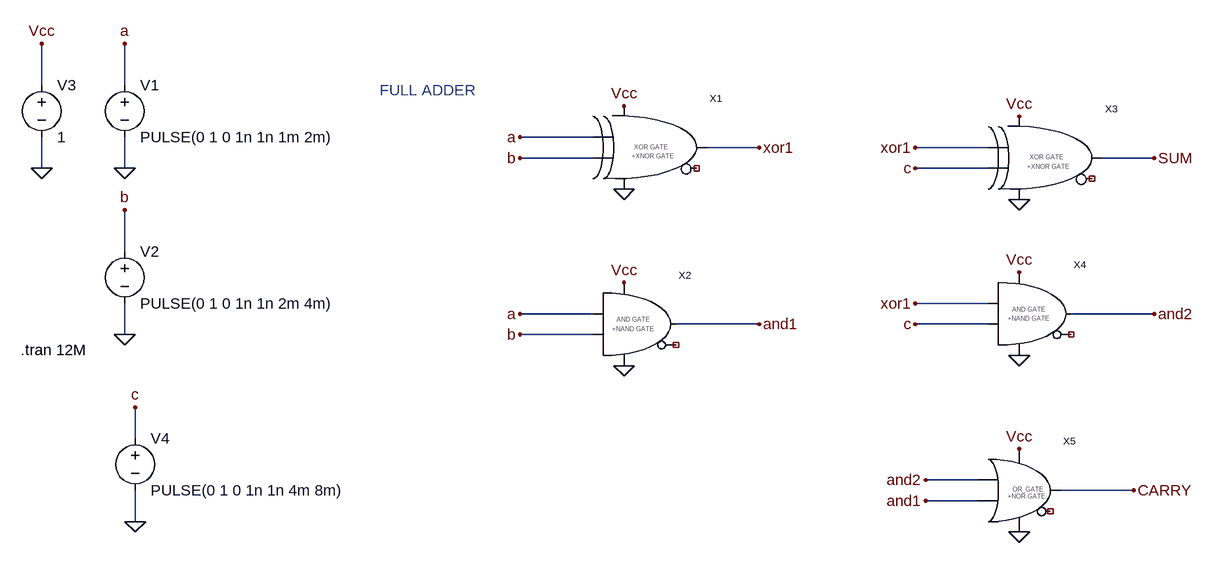
[diagram p0: schematic Draft68.asc]
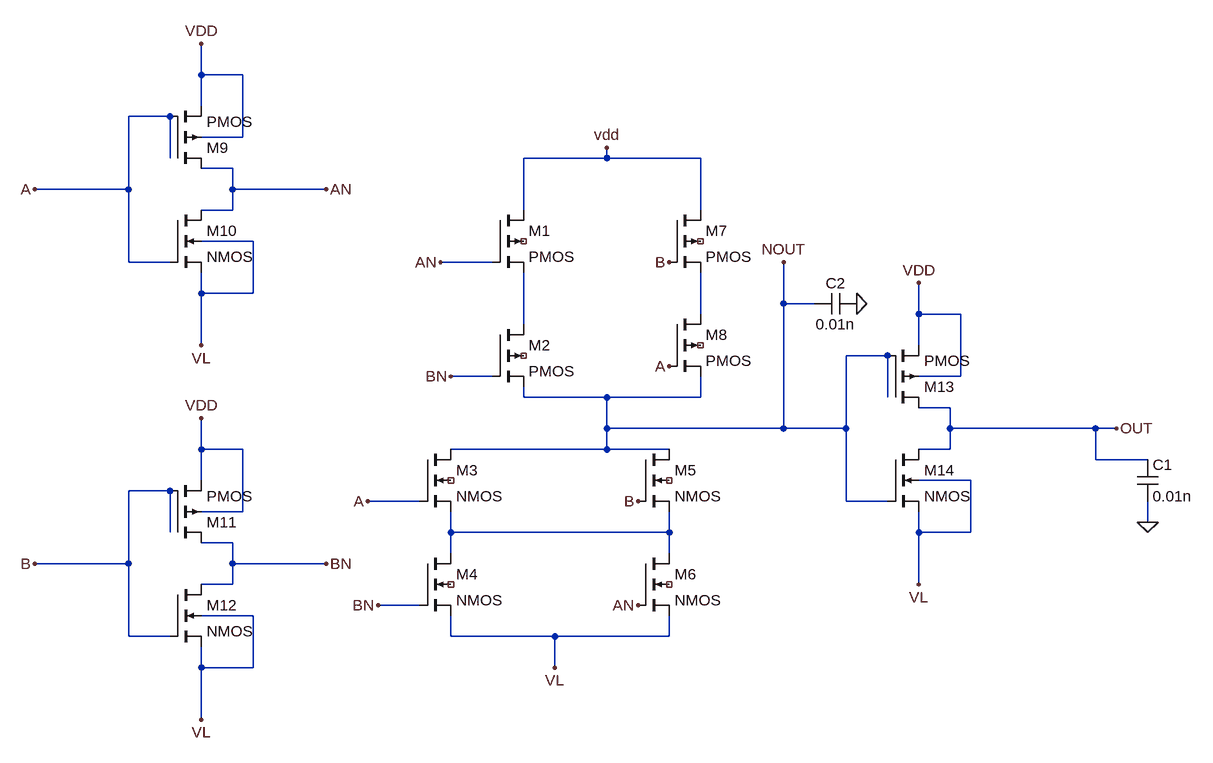
[diagram p1: sub-circuit xor_gate.asc]
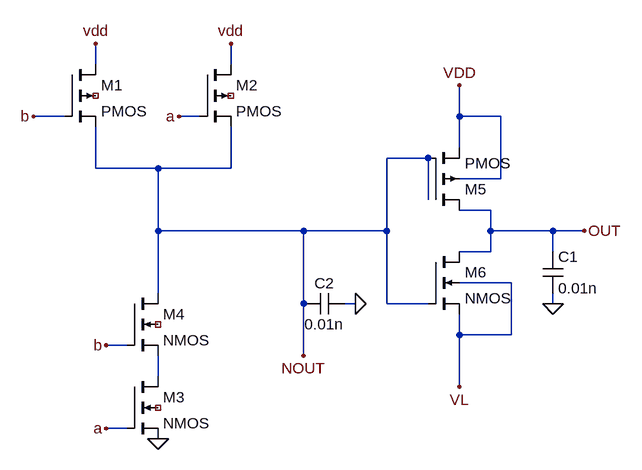
[diagram p2: sub-circuit and_gate1.asc]
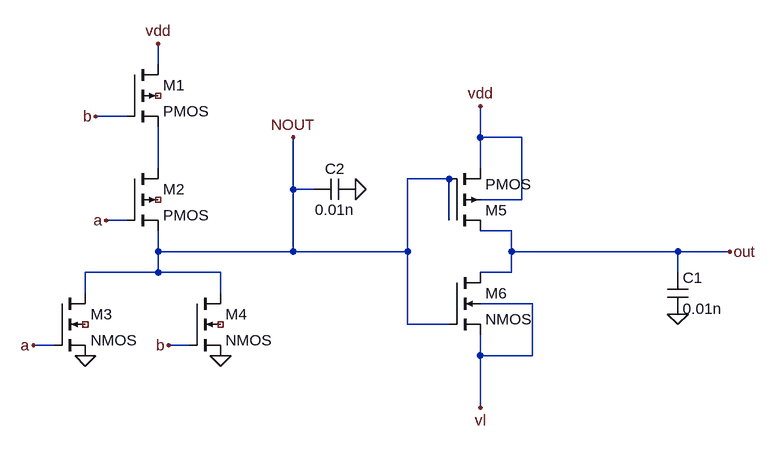
[diagram p3: sub-circuit or_gate1.asc]
Draft68.asc, the LTspice schematic file:
Version 4
SHEET 1 1216 680
WIRE -592 -144 -592 -208
WIRE -464 -144 -464 -208
WIRE 256 -64 144 -64
WIRE 512 -48 432 -48
WIRE 864 -48 752 -48
WIRE 256 -32 144 -32
WIRE 1120 -32 1040 -32
WIRE -592 -16 -592 -64
WIRE -464 -16 -464 -64
WIRE 864 -16 752 -16
WIRE -464 112 -464 48
WIRE 864 192 752 192
WIRE 256 208 144 208
WIRE 1120 208 992 208
WIRE 512 224 384 224
WIRE 864 224 752 224
WIRE -464 240 -464 192
WIRE 256 240 144 240
WIRE -448 400 -448 352
WIRE 848 464 768 464
WIRE 1088 480 976 480
WIRE 848 496 768 496
WIRE -448 528 -448 480
FLAG -592 -208 Vcc
FLAG -464 240 0
FLAG -464 -16 0
FLAG -592 -16 0
FLAG -464 -208 a
FLAG -464 48 b
FLAG 144 -64 a
FLAG 144 -32 b
FLAG 144 208 a
FLAG 144 240 b
FLAG 304 -112 Vcc
FLAG 304 160 Vcc
FLAG 304 16 0
FLAG 304 288 0
FLAG 512 224 and1
FLAG 512 -48 xor1
FLAG 752 -48 xor1
FLAG 752 -16 c
FLAG 912 -96 Vcc
FLAG 912 32 0
FLAG 1120 -32 SUM
FLAG 752 192 xor1
FLAG 752 224 c
FLAG 912 144 Vcc
FLAG 912 272 0
FLAG 1120 208 and2
FLAG -448 528 0
FLAG -448 352 c
FLAG 768 496 and1
FLAG 768 464 and2
FLAG 1088 480 CARRY
FLAG 912 416 Vcc
FLAG 912 544 0
SYMBOL XOR_GATE 256 -32 R0
SYMATTR InstName X1
SYMBOL AND_GATE1 208 240 R0
SYMATTR InstName X2
SYMBOL voltage -464 -160 R0
WINDOW 123 0 0 Left 0
WINDOW 39 0 0 Left 0
SYMATTR InstName V1
SYMATTR Value PULSE(0 1 0 1n 1n 1m 2m)
SYMBOL voltage -464 96 R0
WINDOW 123 0 0 Left 0
WINDOW 39 0 0 Left 0
SYMATTR InstName V2
SYMATTR Value PULSE(0 1 0 1n 1n 2m 4m)
SYMBOL voltage -592 -160 R0
WINDOW 123 0 0 Left 0
WINDOW 39 0 0 Left 0
SYMATTR InstName V3
SYMATTR Value 1
SYMBOL XOR_GATE 864 -16 R0
SYMATTR InstName X3
SYMBOL AND_GATE1 816 224 R0
SYMATTR InstName X4
SYMBOL or_gate1 816 512 R0
SYMATTR InstName X5
SYMBOL voltage -448 384 R0
WINDOW 123 0 0 Left 0
WINDOW 39 0 0 Left 0
SYMATTR InstName V4
SYMATTR Value PULSE(0 1 0 1n 1n 4m 8m)
TEXT -624 264 Left 2 !.tran 12M
TEXT -72 -136 Left 2 ;FULL ADDER

xor_gate.asc, the sub-circuit schematic file:
Version 4
SHEET 1 1020 680
WIRE -512 -432 -512 -480
WIRE -448 -432 -512 -432
WIRE -512 -384 -512 -432
WIRE -560 -368 -624 -368
WIRE -448 -336 -448 -432
WIRE -448 -336 -512 -336
WIRE -560 -304 -560 -368
WIRE 112 -304 112 -320
WIRE 112 -304 -16 -304
WIRE 256 -304 112 -304
WIRE -464 -288 -512 -288
WIRE -624 -256 -624 -368
WIRE -624 -256 -768 -256
WIRE -464 -256 -464 -288
WIRE -320 -256 -464 -256
WIRE -464 -224 -464 -256
WIRE -464 -224 -512 -224
WIRE -16 -224 -16 -304
WIRE 256 -224 256 -304
WIRE -432 -176 -512 -176
WIRE -624 -144 -624 -256
WIRE -560 -144 -624 -144
WIRE -64 -144 -144 -144
WIRE -512 -96 -512 -128
WIRE -432 -96 -432 -176
WIRE -432 -96 -512 -96
WIRE 384 -80 384 -144
WIRE 432 -80 384 -80
WIRE 256 -64 256 -128
WIRE 592 -64 592 -112
WIRE 656 -64 592 -64
WIRE -16 -48 -16 -128
WIRE -512 -16 -512 -96
WIRE 592 -16 592 -64
WIRE 544 0 480 0
WIRE -64 32 -128 32
WIRE 656 32 656 -64
WIRE 656 32 592 32
WIRE -16 64 -16 48
WIRE 112 64 -16 64
WIRE 256 64 256 32
WIRE 256 64 112 64
WIRE 544 64 544 0
WIRE 640 80 592 80
WIRE 112 112 112 64
WIRE 384 112 384 -80
WIRE 384 112 112 112
WIRE 480 112 480 0
WIRE 480 112 384 112
WIRE 640 112 640 80
WIRE 864 112 640 112
WIRE 896 112 864 112
WIRE -512 144 -512 96
WIRE -448 144 -512 144
WIRE 112 144 112 112
WIRE 112 144 -128 144
WIRE 208 144 112 144
WIRE 640 144 640 112
WIRE 640 144 592 144
WIRE 864 160 864 112
WIRE 944 160 864 160
WIRE -512 192 -512 144
WIRE 672 192 592 192
WIRE -560 208 -624 208
WIRE -176 224 -256 224
WIRE 480 224 480 112
WIRE 544 224 480 224
WIRE -448 240 -448 144
WIRE -448 240 -512 240
WIRE 944 256 944 224
WIRE -560 272 -560 208
WIRE -128 272 -128 240
WIRE 208 272 208 240
WIRE 208 272 -128 272
WIRE 592 272 592 240
WIRE 672 272 672 192
WIRE 672 272 592 272
WIRE -464 288 -512 288
WIRE -128 304 -128 272
WIRE 208 304 208 272
WIRE -624 320 -624 208
WIRE -624 320 -768 320
WIRE -464 320 -464 288
WIRE -320 320 -464 320
WIRE -464 352 -464 320
WIRE -464 352 -512 352
WIRE 592 352 592 272
WIRE -176 384 -240 384
WIRE -432 400 -512 400
WIRE -624 432 -624 320
WIRE -560 432 -624 432
WIRE -128 432 -128 400
WIRE 32 432 -128 432
WIRE 208 432 208 400
WIRE 208 432 32 432
WIRE -512 480 -512 448
WIRE -432 480 -432 400
WIRE -432 480 -512 480
WIRE 32 480 32 432
WIRE -512 560 -512 480
FLAG -144 -144 AN
FLAG 160 224 B
FLAG -256 224 A
FLAG -128 32 BN
FLAG 112 -320 vdd
FLAG 208 -144 B
FLAG 208 16 A
FLAG -240 384 BN
FLAG 896 112 OUT
FLAG 160 384 AN
FLAG 944 256 0
FLAG -320 -256 AN
FLAG -512 -16 VL
FLAG -512 -480 VDD
FLAG -768 -256 A
FLAG -320 320 BN
FLAG -512 560 VL
FLAG -512 96 VDD
FLAG -768 320 B
FLAG 32 480 VL
FLAG 592 352 VL
FLAG 592 -112 VDD
FLAG 384 -144 NOUT
FLAG 496 -80 0
SYMBOL pmos4 -64 -224 R0
SYMATTR InstName M1
SYMBOL pmos4 -64 -48 R0
SYMATTR InstName M2
SYMBOL nmos4 -176 144 R0
SYMATTR InstName M3
SYMBOL nmos4 -176 304 R0
SYMATTR InstName M4
SYMBOL nmos4 160 144 R0
SYMATTR InstName M5
SYMBOL nmos4 160 304 R0
SYMATTR InstName M6
SYMBOL pmos4 208 -224 R0
SYMATTR InstName M7
SYMBOL pmos4 208 -64 R0
SYMATTR InstName M8
SYMBOL cap 928 160 R0
SYMATTR InstName C1
SYMATTR Value 0.01n
SYMBOL pmos4 -560 -288 M180
SYMATTR InstName M9
SYMBOL nmos4 -560 -224 R0
SYMATTR InstName M10
SYMBOL pmos4 -560 288 M180
SYMATTR InstName M11
SYMBOL nmos4 -560 352 R0
SYMATTR InstName M12
SYMBOL pmos4 544 80 M180
SYMATTR InstName M13
SYMBOL nmos4 544 144 R0
SYMATTR InstName M14
SYMBOL cap 496 -96 R90
WINDOW 0 0 32 VBottom 2
WINDOW 3 32 32 VTop 2
SYMATTR InstName C2
SYMATTR Value 0.01n

and_gate1.asc, the sub-circuit schematic file:
Version 4
SHEET 1 880 680
WIRE 16 -128 16 -160
WIRE 224 -128 224 -160
WIRE -32 -48 -80 -48
WIRE 176 -48 144 -48
WIRE 576 -48 576 -96
WIRE 640 -48 576 -48
WIRE 576 0 576 -48
WIRE 528 16 464 16
WIRE 16 32 16 -32
WIRE 112 32 16 32
WIRE 224 32 224 -32
WIRE 224 32 112 32
WIRE 640 48 640 -48
WIRE 640 48 576 48
WIRE 528 80 528 16
WIRE 624 96 576 96
WIRE 112 128 112 32
WIRE 336 128 112 128
WIRE 464 128 464 16
WIRE 464 128 336 128
WIRE 624 128 624 96
WIRE 720 128 624 128
WIRE 768 128 720 128
WIRE 624 160 624 128
WIRE 624 160 576 160
WIRE 720 160 720 128
WIRE 656 208 576 208
WIRE 112 224 112 128
WIRE 336 240 336 128
WIRE 416 240 400 240
WIRE 464 240 464 128
WIRE 528 240 464 240
WIRE 720 240 720 224
WIRE 576 288 576 256
WIRE 656 288 656 208
WIRE 656 288 576 288
WIRE 64 304 32 304
WIRE 336 320 336 240
WIRE 112 352 112 320
WIRE 576 368 576 288
WIRE 64 432 32 432
FLAG 16 -160 vdd
FLAG -80 -48 b
FLAG 144 -48 a
FLAG 32 304 b
FLAG 32 432 a
FLAG 112 448 0
FLAG 224 -160 vdd
FLAG 768 128 OUT
FLAG 576 -96 VDD
FLAG 720 240 0
FLAG 416 240 0
FLAG 336 320 NOUT
FLAG 576 368 VL
SYMBOL pmos4 -32 -128 R0
SYMATTR InstName M1
SYMBOL pmos4 176 -128 R0
SYMATTR InstName M2
SYMBOL nmos4 64 352 R0
SYMATTR InstName M3
SYMBOL nmos4 64 224 R0
SYMATTR InstName M4
SYMBOL pmos4 528 96 M180
SYMATTR InstName M5
SYMBOL nmos4 528 160 R0
SYMATTR InstName M6
SYMBOL cap 704 160 R0
SYMATTR InstName C1
SYMATTR Value 0.01n
SYMBOL cap 336 256 R270
WINDOW 0 32 32 VTop 2
WINDOW 3 0 32 VBottom 2
SYMATTR InstName C2
SYMATTR Value 0.01n

or_gate1.asc, the sub-circuit schematic file:
Version 4
SHEET 1 880 680
WIRE -144 -176 -144 -208
WIRE -192 -96 -240 -96
WIRE 352 -64 352 -112
WIRE 416 -64 352 -64
WIRE -144 -16 -144 -80
WIRE 352 -16 352 -64
WIRE 304 0 240 0
WIRE 64 16 64 -64
WIRE 96 16 64 16
WIRE 416 32 416 -64
WIRE 416 32 352 32
WIRE -192 64 -224 64
WIRE 304 64 304 0
WIRE 400 80 352 80
WIRE -144 112 -144 80
WIRE 64 112 64 16
WIRE 64 112 -144 112
WIRE 240 112 240 0
WIRE 240 112 64 112
WIRE 400 112 400 80
WIRE 656 112 400 112
WIRE 736 112 656 112
WIRE -144 144 -144 112
WIRE -144 144 -256 144
WIRE -48 144 -144 144
WIRE 400 144 400 112
WIRE 400 144 352 144
WIRE 656 144 656 112
WIRE -256 176 -256 144
WIRE -48 176 -48 144
WIRE 432 192 352 192
WIRE 240 224 240 112
WIRE 304 224 240 224
WIRE -304 256 -336 256
WIRE -96 256 -128 256
WIRE 352 272 352 240
WIRE 432 272 432 192
WIRE 432 272 352 272
WIRE 352 352 352 272
FLAG -144 -208 vdd
FLAG -240 -96 b
FLAG -224 64 a
FLAG 736 112 out
FLAG -128 256 b
FLAG -336 256 a
FLAG -48 272 0
FLAG -256 272 0
FLAG 656 208 0
FLAG 352 -112 vdd
FLAG 352 352 vl
FLAG 64 -64 NOUT
FLAG 160 16 0
SYMBOL pmos4 -192 -176 R0
SYMATTR InstName M1
SYMBOL pmos4 -192 -16 R0
SYMATTR InstName M2
SYMBOL nmos4 -304 176 R0
SYMATTR InstName M3
SYMBOL nmos4 -96 176 R0
SYMATTR InstName M4
SYMBOL cap 640 144 R0
SYMATTR InstName C1
SYMATTR Value 0.01n
SYMBOL pmos4 304 80 M180
SYMATTR InstName M5
SYMBOL nmos4 304 144 R0
SYMATTR InstName M6
SYMBOL cap 96 32 R270
WINDOW 0 32 32 VTop 2
WINDOW 3 0 32 VBottom 2
SYMATTR InstName C2
SYMATTR Value 0.01n

The netlist it stands for:
* Draft68.asc
XX1 a b Vcc 0 xor1 NC_01 xor_gate
XX2 a b Vcc 0 and1 NC_02 and_gate1
V1 a 0 PULSE(0 1 0 1n 1n 1m 2m)
V2 b 0 PULSE(0 1 0 1n 1n 2m 4m)
V3 Vcc 0 1
XX3 xor1 c Vcc 0 SUM NC_03 xor_gate
XX4 xor1 c Vcc 0 and2 NC_04 and_gate1
XX5 and2 and1 Vcc 0 CARRY NC_05 or_gate1
V4 c 0 PULSE(0 1 0 1n 1n 4m 8m)

* block symbol definitions
.subckt xor_gate A B VDD VL OUT NOUT
M1 vdd AN N002 NC_01 PMOS
M2 N002 BN NOUT NC_02 PMOS
M3 NOUT A N003 NC_03 NMOS
M4 N003 BN VL NC_04 NMOS
M5 NOUT B N003 NC_05 NMOS
M6 N003 AN VL NC_06 NMOS
M7 vdd B N001 NC_07 PMOS
M8 N001 A NOUT NC_08 PMOS
C1 OUT 0 0.01n
M9 AN A vdd vdd PMOS
M10 AN A VL VL NMOS
M11 BN B vdd vdd PMOS
M12 BN B VL VL NMOS
M13 OUT NOUT vdd vdd PMOS
M14 OUT NOUT VL VL NMOS
C2 0 NOUT 0.01n
.ends xor_gate

.subckt and_gate1 A B VDD VL OUT NOUT
M1 vdd b NOUT NC_01 PMOS
M2 vdd a NOUT NC_02 PMOS
M3 N001 a 0 NC_03 NMOS
M4 NOUT b N001 NC_04 NMOS
M5 OUT NOUT vdd vdd PMOS
M6 OUT NOUT VL VL NMOS
C1 OUT 0 0.01n
C2 NOUT 0 0.01n
.ends and_gate1

.subckt or_gate1 a b vdd vl out NOUT
M1 vdd b N001 NC_01 PMOS
M2 N001 a NOUT NC_02 PMOS
M3 NOUT a 0 NC_03 NMOS
M4 NOUT b 0 NC_04 NMOS
C1 out 0 0.01n
M5 out NOUT vdd vdd PMOS
M6 out NOUT vl vl NMOS
C2 NOUT 0 0.01n
.ends or_gate1

.model NMOS NMOS
.model PMOS PMOS
.lib standard.mos
.tran 12M
* FULL ADDER
.backanno
.end